# Altium schematic sheet MCU.SchDoc
size A4; SheetNumber: 2; SheetTotal: 14
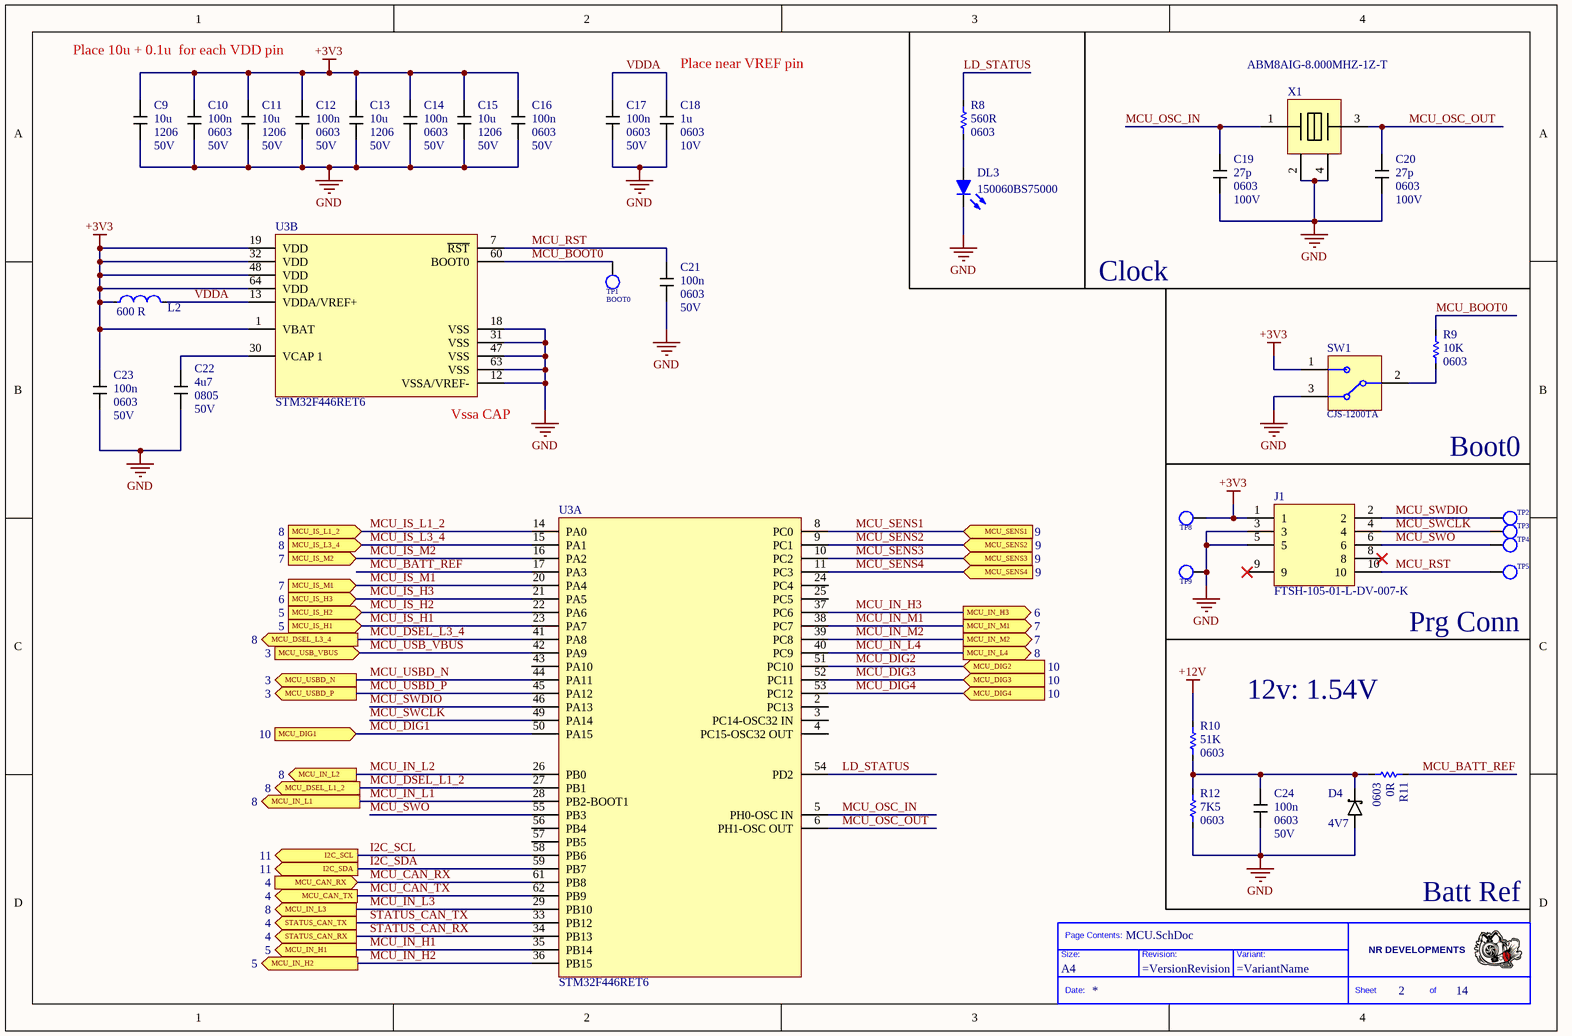
[diagram p0: MCU.SchDoc]

## Parts
*  Size: A4  (hidden comment: Title_Block)  (graphical)
C9  value 10u  Case: 1206  Voltage: 50V  [CAPC3216X16M]  (hidden comment: CAP)
C10  value 100n  Case: 0603  Voltage: 50V  [CAPC1608X09M]  (hidden comment: CAP)
C11  value 10u  Case: 1206  Voltage: 50V  [CAPC3216X16M]  (hidden comment: CAP)
C12  value 100n  Case: 0603  Voltage: 50V  [CAPC1608X09M]  (hidden comment: CAP)
C13  value 10u  Case: 1206  Voltage: 50V  [CAPC3216X16M]  (hidden comment: CAP)
C14  value 100n  Case: 0603  Voltage: 50V  [CAPC1608X09M]  (hidden comment: CAP)
C15  value 10u  Case: 1206  Voltage: 50V  [CAPC3216X16M]  (hidden comment: CAP)
C16  value 100n  Case: 0603  Voltage: 50V  [CAPC1608X09M]  (hidden comment: CAP)
C17  value 100n  Case: 0603  Voltage: 50V  [CAPC1608X09M]  (hidden comment: CAP)
C18  value 1u  Case: 0603  Voltage: 10V  [CAPC1608X09M]  (hidden comment: CAP)
C19  value 27p  Case: 0603  Voltage: 100V  [CAPC1608X09M]  (hidden comment: CAP)
C20  value 27p  Case: 0603  Voltage: 100V  [CAPC1608X09M]  (hidden comment: CAP)
C21  value 100n  Case: 0603  Voltage: 50V  [CAPC1608X09M]  (hidden comment: CAP)
C22  value 4u7  Case: 0805  Voltage: 50V  [CAPC2012X14N]  (hidden comment: CAP)
C23  value 100n  Case: 0603  Voltage: 50V  [CAPC1608X09M]  (hidden comment: CAP)
C24  value 100n  Case: 0603  Voltage: 50V  [CAPC1608X09M]  (hidden comment: CAP)
D4  value 4V7  [SOT65P210X100-3N - AC]  (hidden comment: Diode_Schottky)
DL3  value 150060BS75000  [LED0603]  (hidden comment: Led_Green)
J1  value FTSH-105-01-L-DV-007-K  [SAMTEC_FTSH-105-X-X-DV-007-P-X]  (hidden comment: Connector)
L2  value 600 R  [INDC1608X09N]  (hidden comment: IND)
R8  value 560R  Case: 0603  [RESC1608X06M]  (hidden comment: Res)
R9  value 10K  Case: 0603  [RESC1608X06M]  (hidden comment: Res)
R10  value 51K  Case: 0603  [RESC1608X06M]  (hidden comment: Res)
R11  value 0R  Case: 0603  [RESC1608X06M]  (hidden comment: Res)
R12  value 7K5  Case: 0603  [RESC1608X06M]  (hidden comment: Res)
SW1  value CJS-1200TA  [SW_CJS-1200TA]  (hidden comment: Switch SPDT)
TP1  BOOT0  [TP_c200]
TP2  DIO  [TP_c200]  (value not drawn)
TP3  CLK  [TP_c200]  (value not drawn)
TP4  SWO  [TP_c200]  (value not drawn)
TP5  RST  [TP_c200]  (value not drawn)
TP8  3V3  [TP_c200]  (value not drawn)
TP9  GND  [TP_c200]  (value not drawn)
U3  STM32F446RET6  [STM-LQFP64_M]  (parts A,B of 2)
X1  ABM8AIG-8.000MHZ-1Z-T  [ABM8G_abracon]

## Ports
I2C_SCL (out, see 11), I2C_SDA (out, see 11), MCU_CAN_RX (in, see 4), MCU_CAN_TX (out, see 4), MCU_DIG1 (in, see 10), MCU_DIG2 (in, see 10), MCU_DIG3 (in, see 10), MCU_DIG4 (in, see 10), MCU_DSEL_L1_2 (out, see 8), MCU_DSEL_L3_4 (out, see 8), MCU_IN_H1 (out, see 5), MCU_IN_H2 (out, see 5), MCU_IN_H3 (out, see 6), MCU_IN_L1 (out, see 8), MCU_IN_L2 (out, see 8), MCU_IN_L3 (out, see 8), MCU_IN_L4 (out, see 8), MCU_IN_M1 (out, see 7), MCU_IN_M2 (out, see 7), MCU_IS_H1 (in, see 5), MCU_IS_H2 (in, see 5), MCU_IS_H3 (in, see 6), MCU_IS_L1_2 (in, see 8), MCU_IS_L3_4 (in, see 8), MCU_IS_M1 (in, see 7), MCU_IS_M2 (in, see 7), MCU_SENS1 (in, see 9), MCU_SENS2 (in, see 9), MCU_SENS3 (in, see 9), MCU_SENS4 (in, see 9), MCU_USB_VBUS (in, see 3), MCU_USBD_N (out, see 3), MCU_USBD_P (out, see 3), STATUS_CAN_RX (out, see 4), STATUS_CAN_TX (out, see 4)

## Nets
+3V3: C9.1 C10.1 C11.1 C12.1 C13.1 C14.1 C15.1 C16.1 C23.1 J1.1 L2.1 SW1.1 TP8.1 U3.1(VBAT) U3.19(VDD) U3.32(VDD) U3.48(VDD) U3.64(VDD)
+12V: R10.2
GND: C9.2 C10.2 C11.2 C12.2 C13.2 C14.2 C15.2 C16.2 C17.2 C18.2 C19.2 C20.2 C21.2 C22.2 C23.2 C24.2 D4.A DL3.C J1.3 J1.5 R12.1 SW1.3 TP9.1 U3.12(VSSA/VREF-) U3.18(VSS) U3.31(VSS) U3.47(VSS) U3.63(VSS) X1.2 X1.4
I2C_SCL: U3.58(PB6) ; port I2C_SCL
I2C_SDA: U3.59(PB7) ; port I2C_SDA
LD_STATUS: R8.2 U3.54(PD2)
MCU_BATT_REF: R11.2 U3.17(PA3)
MCU_BOOT0: R9.2 TP1.1 U3.60(BOOT0)
MCU_CAN_RX: U3.61(PB8) ; port MCU_CAN_RX
MCU_CAN_TX: U3.62(PB9) ; port MCU_CAN_TX
MCU_DIG1: U3.50(PA15) ; port MCU_DIG1
MCU_DIG2: U3.51(PC10) ; port MCU_DIG2
MCU_DIG3: U3.52(PC11) ; port MCU_DIG3
MCU_DIG4: U3.53(PC12) ; port MCU_DIG4
MCU_DSEL_L1_2: U3.27(PB1) ; port MCU_DSEL_L1_2
MCU_DSEL_L3_4: U3.41(PA8) ; port MCU_DSEL_L3_4
MCU_IN_H1: U3.35(PB14) ; port MCU_IN_H1
MCU_IN_H2: U3.36(PB15) ; port MCU_IN_H2
MCU_IN_H3: U3.37(PC6) ; port MCU_IN_H3
MCU_IN_L1: U3.28(PB2-BOOT1) ; port MCU_IN_L1
MCU_IN_L2: U3.26(PB0) ; port MCU_IN_L2
MCU_IN_L3: U3.29(PB10) ; port MCU_IN_L3
MCU_IN_L4: U3.40(PC9) ; port MCU_IN_L4
MCU_IN_M1: U3.38(PC7) ; port MCU_IN_M1
MCU_IN_M2: U3.39(PC8) ; port MCU_IN_M2
MCU_IS_H1: U3.23(PA7) ; port MCU_IS_H1
MCU_IS_H2: U3.22(PA6) ; port MCU_IS_H2
MCU_IS_H3: U3.21(PA5) ; port MCU_IS_H3
MCU_IS_L1_2: U3.14(PA0) ; port MCU_IS_L1_2
MCU_IS_L3_4: U3.15(PA1) ; port MCU_IS_L3_4
MCU_IS_M1: U3.20(PA4) ; port MCU_IS_M1
MCU_IS_M2: U3.16(PA2) ; port MCU_IS_M2
MCU_OSC_IN: C19.1 U3.5(PH0-OSC_IN) X1.1
MCU_OSC_OUT: C20.1 U3.6(PH1-OSC_OUT) X1.3
MCU_RST: C21.1 J1.10 TP5.1 U3.7(~{RST})
MCU_SENS1: U3.8(PC0) ; port MCU_SENS1
MCU_SENS2: U3.9(PC1) ; port MCU_SENS2
MCU_SENS3: U3.10(PC2) ; port MCU_SENS3
MCU_SENS4: U3.11(PC3) ; port MCU_SENS4
MCU_SWCLK: J1.4 TP3.1 U3.49(PA14)
MCU_SWDIO: J1.2 TP2.1 U3.46(PA13)
MCU_SWO: J1.6 TP4.1 U3.55(PB3)
MCU_USB_VBUS: U3.42(PA9) ; port MCU_USB_VBUS
MCU_USBD_N: U3.44(PA11) ; port MCU_USBD_N
MCU_USBD_P: U3.45(PA12) ; port MCU_USBD_P
STATUS_CAN_RX: U3.34(PB13) ; port STATUS_CAN_RX
STATUS_CAN_TX: U3.33(PB12) ; port STATUS_CAN_TX
VDDA: C17.1 C18.1 L2.2 U3.13(VDDA/VREF+)
NetC22_1: C22.1 U3.30(VCAP_1)
NetC24_1: C24.1 D4.C R10.1 R11.1 R12.2
NetDL3_A: DL3.A R8.1
NetR9_1: R9.1 SW1.2

Not connected (* = marked no-connect by the designer): J1 8* 9*; U3 2(PC13) 3(PC14-OSC32_IN) 4(PC15-OSC32_OUT) 24(PC4) 25(PC5) 43(PA10) 56(PB4) 57(PB5)

## Notes on the sheet
- Place 10u + 0.1u  for each VDD pin
- (near C18) Place near VREF pin
- Clock
- (near U3) Vssa CAP
- Boot0
- (near TP5) Prg Conn
- 12v: 1.54V
- Batt Ref
- (in symbol Title_Block) Page Contents:; NR DEVELOPMENTS; Size:; Revision:; Variant:; Date:; Sheet; of

## Library data of the parts
C9 C11 C13 C15 = CAP: Manufacturer: Samsung Electro-Mechanics; PartNumber: CL31B106KBHNNNE
C10 C12 C14 C16 C17 C21 C23 C24 = CAP: Manufacturer: KEMET; PartNumber: C0603C104K5RACTU
C18 = CAP: Manufacturer: KEMET; PartNumber: C0603C105K8RACTU
C19 C20 = CAP: Manufacturer: YAGEO; PartNumber: CC0603FRNPO0BN270
C22 = CAP: Manufacturer: KEMET; PartNumber: C1206C475K5RACTU
D4 = Diode_Schottky: Manufacturer: Nexperia; PartNumber: BZX84W-C4V7-QX; Case: SOT323
DL3 = LED_Blue: Manufacturer: Wurth Elektronik; Case: 0603; PartNumber: 150060BS75000
J1 = FTSH-105-X-X-DV-007-P-X: Manufacturer: Samtech; PartNumber: FTSH-105-01-L-DV-007-K
L2 = IND: Manufacturer: TDK; PartNumber: MMZ1608R601ATD25; Case: 0603
R8 = Resistor: Manufacturer: Vishay; PartNumber: RC0603FR-07560RL
R9 = Resistor: Manufacturer: YAGEO; PartNumber: AC0603FR-0710KL
R10 = Resistor: Manufacturer: Vishay; PartNumber: CRCW060351K0FKEA
R11 = Resistor: Manufacturer: YAGEO; PartNumber: RC0603JR-070RL
R12 = Resistor: Manufacturer: Vishay; PartNumber: CRCW06037K50FKEA
SW1 = SWITCH_SPDT: Manufacturer: Nidec Components; PartNumber: CJS-1200TA
TP1-TP5 TP8 TP9 = Test_Point
U3 = STM32F446RET6: IC MCU 32BIT 512KB FLASH 64LQFP; Manufacturer: ST; PartNumber: STM32F446RET6
X1 = Crystal: Manufacturer: Abracom; Value: ABM8AIG-8.000MHZ-1Z-T; PartNumber: ABM8AIG-8.000MHZ-1Z-T